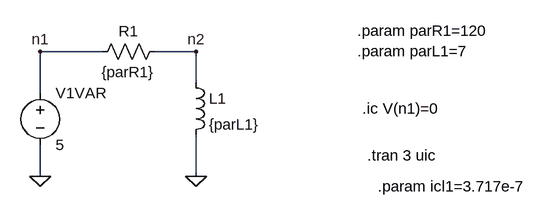
[diagram p0: schematic Circuit.asc]
Circuit.asc, the LTspice schematic file:
Version 4
SHEET 1 976 680
WIRE 240 48 144 48
WIRE 384 48 320 48
WIRE 384 96 384 48
WIRE 144 112 144 48
WIRE 144 240 144 192
WIRE 384 240 384 176
FLAG 144 240 0
FLAG 384 240 0
FLAG 144 48 n1
FLAG 384 48 n2
SYMBOL voltage 144 96 R0
SYMATTR InstName V1VAR
SYMATTR Value 5
SYMBOL res 336 32 R90
WINDOW 0 0 56 VBottom 2
WINDOW 3 32 56 VTop 2
SYMATTR InstName R1
SYMATTR Value {parR1}
SYMBOL ind 368 80 R0
SYMATTR InstName L1
SYMATTR Value {parL1}
TEXT 632 16 Left 2 !.param parR1=120\n.param parL1=7
TEXT 640 136 Left 2 !.ic V(n1)=0
TEXT 648 208 Left 2 !.tran 3 uic
TEXT 664 256 Left 2 !.param icl1=3.717e-7

The netlist it stands for:
* Circuit.asc
V1VAR n1 0 5
R1 n2 n1 {parR1}
L1 n2 0 {parL1}
.param parR1=120
.param parL1=7
.ic V(n1)=0
.tran 3 uic
.param icl1=3.717e-7
.backanno
.end

* Results of the author's LTspice run, read from the files saved beside the schematic
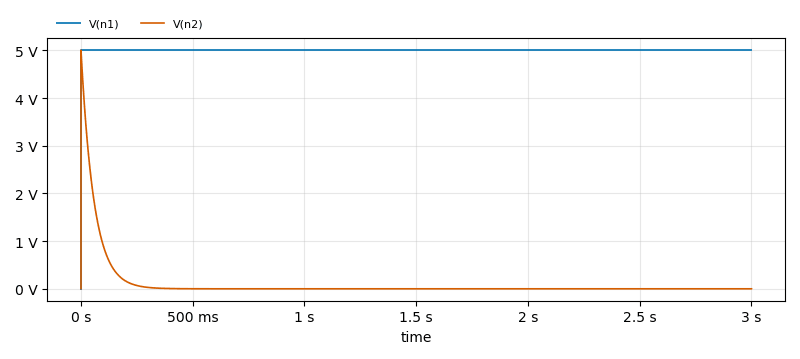
[diagram p1: Transient Analysis of Circuit.asc, plotted from the saved traces]
* Transient Analysis, 1 run:
*   V(n1): min 0 V, max 5 V, average 5 V, rms 5 V, last 5 V
*   V(n2): min 0 V, max 5 V, average 97.37 mV, rms 493.7 mV, last 41.67 µV